# EAGLE design ServoEncoder_Serial (EAGLE 8.7.1)
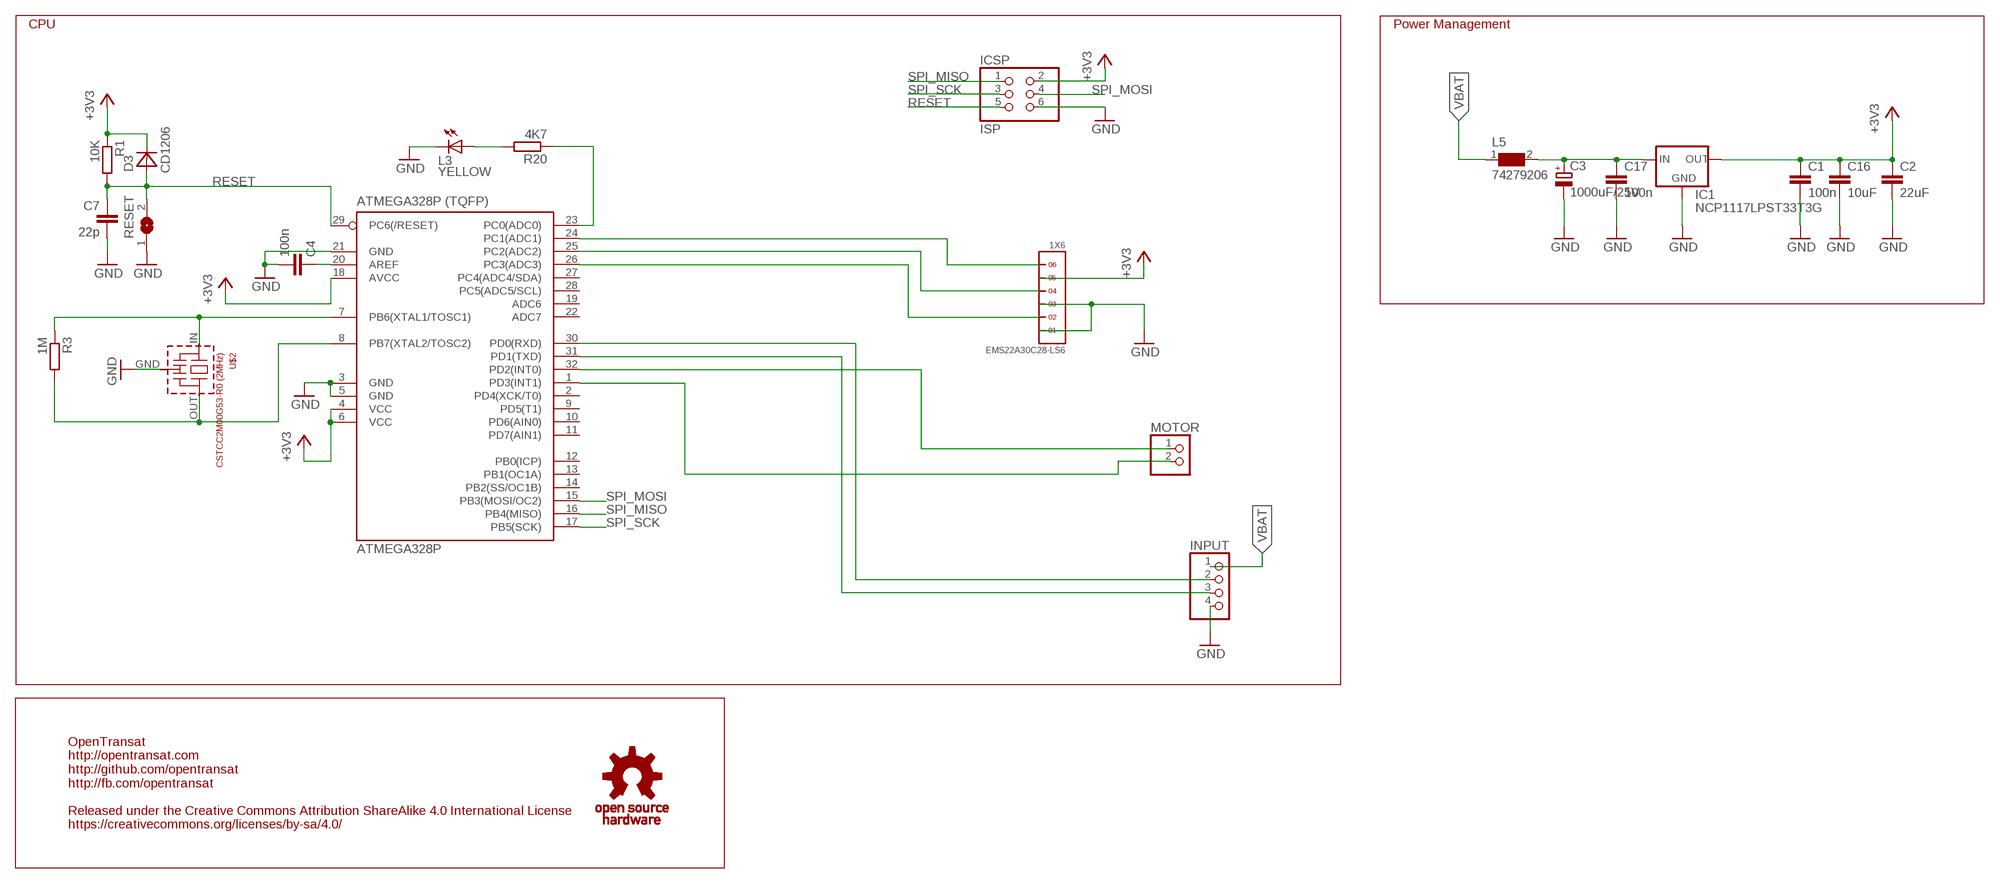
[diagram p0: schematic, sheet 1]

## Parts
ATMEGA328P  ATMEGA328P (TQFP)  MEGA8-AI  [TQFP32-08]
C1  100n  C-EUC0603  [C0603]
C2  22uF  C-EUC1210  [C1210]
C3  1000uF/25V  CPOL-EUE5-10.5  [E5-10,5]
C4  100n  C-EUC0603  [C0603]
C7  22p  C-EUC0603  [C0603]
C16  10uF  C-EUC1206  [C1206]
C17  100n  C-EUC0603  [C0603]
D3  CD1206  [R1206]
EMS22A30C28-LS6  1X6  [1X6]
IC1  NCP1117LPST33T3G  LM1117MP-3.3  [SOT223]
ICSP  ISP  PINHD-2X3  [2X03]
INPUT  PINHD-1X4  [1X04]
L3  YELLOW  LEDCHIPLED_0805  [CHIPLED_0805]
L5  74279206  WE-CBF_0805  [0805]
MOTOR  PINHD-1X2  [1X02]
R1  10K  R-EU_R0603  [R0603]
R3  1M  R-EU_R0603  [R0603]
R20  4K7  R-EU_R0603  [R0603]
RESET  SJW  [SJW]
U$1  OSHW_S  [OSHWS]
U$2  CSTCC2M00G53-R0 (2MHz)  CSTCC  [CSTCC]

## Nets
+3V3: ATMEGA328P.4(VCC) ATMEGA328P.6(VCC) ATMEGA328P.18(AVCC) C1.1 C2.1 C16.1 D3.2(C) EMS22A30C28-LS6.5 IC1.2(OUT) IC1.4(OUT) ICSP.2 R1.1
AREF: ATMEGA328P.20(AREF) C4.1
GND [GND]: ATMEGA328P.3(GND) ATMEGA328P.5(GND) ATMEGA328P.21(GND) C1.2 C2.2 C3.- C4.2 C7.2 C16.2 C17.2 EMS22A30C28-LS6.1 EMS22A30C28-LS6.3 IC1.1(GND) ICSP.6 INPUT.4 L3.C RESET.1 U$2.GND
L13: ATMEGA328P.23(PC0(ADC0)) R20.1
N$1: C3.+ C17.1 IC1.3(IN) L5.2
N$3: ATMEGA328P.30(PD0(RXD)) INPUT.2
N$4: L3.A R20.2
N$5: ATMEGA328P.31(PD1(TXD)) INPUT.3
N$6: ATMEGA328P.1(PD3(INT1)) MOTOR.2
N$7: ATMEGA328P.24(PC1(ADC1)) EMS22A30C28-LS6.6
N$8: ATMEGA328P.25(PC2(ADC2)) EMS22A30C28-LS6.4
N$9: ATMEGA328P.26(PC3(ADC3)) EMS22A30C28-LS6.2
N$11: ATMEGA328P.32(PD2(INT0)) MOTOR.1
RESET: ATMEGA328P.29(PC6(/RESET)) C7.1 D3.1(A) ICSP.5 R1.2 RESET.2
SPI_MISO: ATMEGA328P.16(PB4(MISO)) ICSP.1
SPI_MOSI: ATMEGA328P.15(PB3(MOSI/OC2)) ICSP.4
SPI_SCK: ATMEGA328P.17(PB5(SCK)) ICSP.3
VBAT: INPUT.1 L5.1
XTAL1: ATMEGA328P.8(PB7(XTAL2/TOSC2)) R3.2 U$2.OUT
XTAL2: ATMEGA328P.7(PB6(XTAL1/TOSC1)) R3.1 U$2.IN
Unconnected: ATMEGA328P.2(PD4(XCK/T0)) ATMEGA328P.9(PD5(T1)) ATMEGA328P.10(PD6(AIN0)) ATMEGA328P.11(PD7(AIN1)) ATMEGA328P.12(PB0(ICP)) ATMEGA328P.13(PB1(OC1A)) ATMEGA328P.14(PB2(SS/OC1B)) ATMEGA328P.19(ADC6) ATMEGA328P.22(ADC7) ATMEGA328P.27(PC4(ADC4/SDA)) ATMEGA328P.28(PC5(ADC5/SCL))

## Notes on the sheet
- CPU | Power Management
- OpenTransat
  http://opentransat.com
  http://github.com/opentransat
  http://fb.com/opentransat
  
  Released under the Creative Commons Attribution ShareAlike 4.0 International License
  https://creativecommons.org/licenses/by-sa/4.0/

## Library data of the parts
ATMEGA328P = atmel:MEGA8: MICROCONTROLLER 8 Kbytes FLASH, 1 kbytes SRAM, 512 bytes EEPROM, USART, 6-channel 10 bit ADC, 2-channel 8 bit ADC Pin compatible with Atmega48, ATMega88, ATMega168 Source: avr.lbr; MPN: ATMEGA8-16AU; OC_FARNELL: 9171371; OC_NEWARK: 73M8863
C1 C2 C4 C7 C16 C17 = rcl:C-EU: CAPACITOR, European symbol
C3 = transducer:CPOL-EU: POLARIZED CAPACITOR, European symbol
D3 = diodes_smd:CD1206
EMS22A30C28-LS6 = headers(2mm):1X6
IC1 = lm1117_10:LM1117?-*: 800mA Low-Dropout Linear Regulator Source: http://www.ti.com/lit/ds/symlink/lm1117-n.pdf; MF: Texas Instruments; MPN: LM1117MP-3.3; OC_FARNELL: 9778195; OC_NEWARK: 28X3416
ICSP = pinhead:PINHD-2X3: PIN HEADER
INPUT = pinhead:PINHD-1X4: PIN HEADER
L3 = led:LED: LED OSRAM: - CHIPLED LG R971, LG N971, LY N971, LG Q971, LY Q971, LO R971, LY R971 LH N974, LH R974 LS Q976, LO Q976, LY Q976 LO Q996 - Hyper CHIPLED LW Q18S LB Q993, LB Q99A, LB R99A - SideLED LS A670, LO A670, LY A670, LG A670, LP A670 LB A673, LV A673, LT A673, LW A673 LH A674 LY A675 LS A676, LA A676, LO A676, LY A676, LW A676 LS A679, LY A679, LG A679 - Hyper Micro SIDELED® LS Y876, LA Y876, LO Y876, LY Y876 LT Y87S - SmartLED LW L88C, LW L88S LB L89C, LB L89S, LG L890 LS L89K, LO L89K, LY L89K LS L896, LA L896, LO L896, LY L896 - TOPLED LS T670, LO T670, LY T670, LG T670, LP T670 LSG T670, LSP T670, LSY T670, LOP T670, LYG T670 LG T671, LOG T671, LSG T671 LB T673, LV T673, LT T673, LW T673 LH T674 LS T676, LA T676, LO T676, LY T676, LB T676, LH T676, LSB T676, LW T676 LB T67C, LV T67C, LT T67C, LS T67K, LO T67K, LY T67K, LW E67C LS E67B, LA E67B, LO E67B, LY E67B, LB E67C, LV E67C, LT E67C LW T67C LS T679, LY T679, LG T679 LS T770, LO T770, LY T770, LG T770, LP T770 LB T773, LV T773, LT T773, LW T773 LH T774 LS E675, LA E675, LY E675, LS T675 LS T776, LA T776, LO T776, LY T776, LB T776 LHGB T686 LT T68C, LB T68C - Hyper Mini TOPLED® LB M676 - Mini TOPLED Santana® LG M470 LS M47K, LO M47K, LY M47K Source: http://www.osram.convergy.de LUXEON: - LUMILED® LXK2-PW12-R00, LXK2-PW12-S00, LXK2-PW14-U00, LXK2-PW14-V00 LXK2-PM12-R00, LXK2-PM12-S00, LXK2-PM14-U00 LXK2-PE12-Q00, LXK2-PE12-R00, LXK2-PE12-S00, LXK2-PE14-T00, LXK2-PE14-U00 LXK2-PB12-K00, LXK2-PB12-L00, LXK2-PB12-M00, LXK2-PB14-N00, LXK2-PB14-P00, LXK2-PB14-Q00 LXK2-PR12-L00, LXK2-PR12-M00, LXK2-PR14-Q00, LXK2-PR14-R00 LXK2-PD12-Q00, LXK2-PD12-R00, LXK2-PD12-S00 LXK2-PH12-R00, LXK2-PH12-S00 LXK2-PL12-P00, LXK2-PL12-Q00, LXK2-PL12-R00 Source: www.luxeon.com KINGBRIGHT: KA-3528ASYC Source: www.kingbright.com
L5 = Wurth_Elektronik_Passive_rev15b:WE-CBF: SMD EMI Suppression Ferrite Beads WE-CBF - Excellent anti-EMI properties - Low DC-restistance - Impedances till 3000 ohms - Rated current up to 6 A -- Reliable Ni-Sn electrodes -- Perfect as data lined filter and for uncoupling of distribution voltage <http://katalog.we-online.de/media/images/eisos/FeCBF_pf2.jpg> Details see: http://katalog.we-online.de/en/pbs/WE-CBF updated by Dan Xu 2014-06-19 2014 (C) Würth Elektronik
MOTOR = pinhead:PINHD-1X2: PIN HEADER
R1 R3 R20 = rcl:R-EU_: RESISTOR, European symbol
RESET = jumper:SJ: SMD solder JUMPER
U$1 = oshw:OSHW_S
U$2 = murata-cstcc-cstcv-resonators:CSTCC: Murata CSTCC Resonator - 7,2 x 3,0 mm

## Net classes
1 power 5V: width 0.305 mm, drill 0.508 mm, clearance 0.203 mm
2 power 3.3V: width 0.305 mm, drill 0.508 mm, clearance 0.203 mm
3 GND: width 0.305 mm, drill 0.508 mm, clearance 0.203 mm
4 3A: width 1.372 mm, drill 0.635 mm, clearance 0.406 mm

## Board
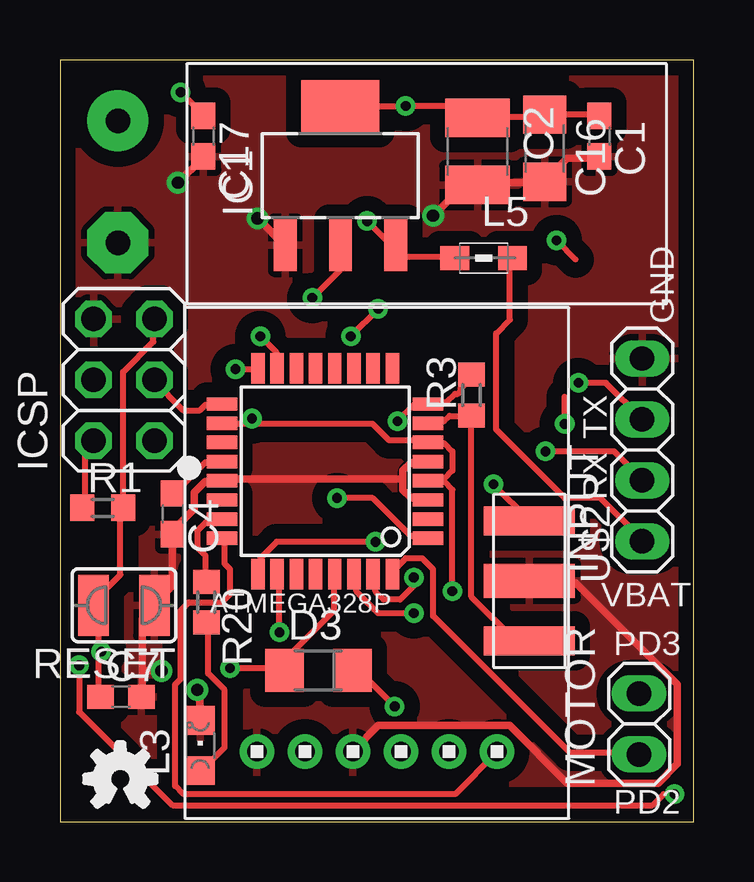
[diagram p1: board, top side]
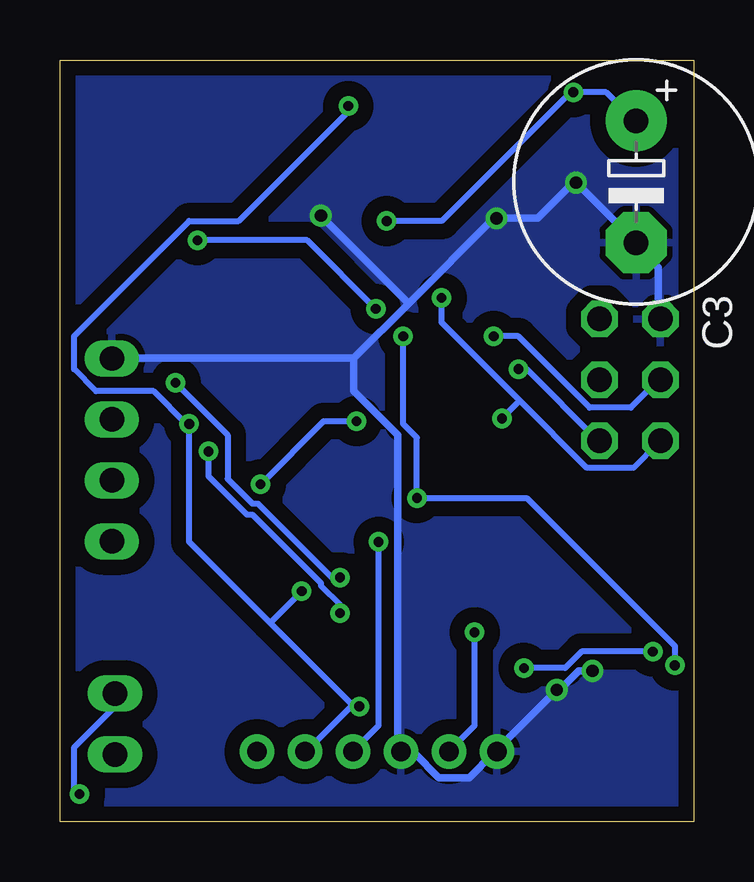
[diagram p2: board, bottom side, seen from below]

Size 26.42 x 31.75 mm. Coordinates in mm from the lower left corner, seen from the top.
Outline: 0,0 26.42,0 26.42,31.75 0,31.75 0,0
Copper layers (1*16): Top 0.035mm / dielectric 0.5mm / Bottom 0.035mm
Design rules "autorouter *": minimum track width 10mil, minimum drill 16mil, track to track 8mil, track to pad 8mil, pad to pad 8mil, via to via 8mil, smd to smd 8mil, copper to edge 15mil, drill to drill 12mil, minimum pad ring 10mil, minimum via ring 8mil, stop-mask expansion 1mil, vias tented up to drill 30mil, thermal gap 10mil

### Footprints (pad centres in the part's own frame; a part is rotated, then mirrored left to right if it is on the bottom)
TQFP32-08 = smd 1.27 x 0.559: 1 -4.293,2.8; 2 -4.293,2; 3 -4.293,1.2; 4 -4.293,0.4; 5 -4.293,-0.4; 6 -4.293,-1.2; 7 -4.293,-2; 8 -4.293,-2.8; 17 4.293,-2.8; 18 4.293,-2; 19 4.293,-1.2; 20 4.293,-0.4; 21 4.293,0.4; 22 4.293,1.2; 23 4.293,2; 24 4.293,2.8 | smd 0.559 x 1.27: 9 -2.8,-4.293; 10 -2,-4.293; 11 -1.2,-4.293; 12 -0.4,-4.293; 13 0.4,-4.293; 14 1.2,-4.293; 15 2,-4.293; 16 2.8,-4.293; 25 2.8,4.293; 26 2,4.293; 27 1.2,4.293; 28 0.4,4.293; 29 -0.4,4.293; 30 -1.2,4.293; 31 -2,4.293; 32 -2.8,4.293
C0603 = smd 1.1 x 1: 1 -0.85,0; 2 0.85,0
C1210 = smd 1.6 x 2.7: 1 -1.4,0; 2 1.4,0
E5-10,5 = drill 1.016 pad 2.54: + -2.54,0 | drill 1.016 pad 2.54 octagon: - 2.54,0
C1206 = smd 1.6 x 1.8: 1 -1.4,0; 2 1.4,0
R1206 = smd 1.6 x 1.803: 1 -1.422,0; 2 1.422,0
1X6 = drill 0.8 pad 1.422: 1 -5,0; 2 -3,0; 3 -1,0; 4 1,0; 5 3,0; 6 5,0
SOT223 = smd 0.95 x 2.15: 1 -2.3,-2.9; 2 0,-2.9; 3 2.3,-2.9 | smd 3.25 x 2.15: 4 0,2.9
2X03 = drill 1.016 octagon: 1 -2.54,-1.27; 2 -2.54,1.27; 3 0,-1.27; 4 0,1.27; 5 2.54,-1.27; 6 2.54,1.27
1X04 = drill 1.016 long: 1 -3.81,0; 2 -1.27,0; 3 1.27,0; 4 3.81,0
CHIPLED_0805 = smd 1.2 x 1.2: A 0,-1.05; C 0,1.05
0805 = smd 1.2 x 1: 1 -1.2,0; 2 1.2,0
1X02 = drill 1.016 long: 1 -1.27,0; 2 1.27,0
R0603 = smd 1 x 1.1: 1 -0.85,0; 2 0.85,0
SJW = smd 1.27 x 2.54: 1 -1.27,0; 2 1.27,0
CSTCC = smd 1.4 x 3.8: GND 0,0 | smd 1.2 x 3.8: IN 2.5,0; OUT -2.5,0

### Placement (x,y rotation side)
ATMEGA328P  11.05,14.61 180 top
C1  22.48,28.57 270 top
C2  17.4,27.94 270 top
C3  2.41,26.67 270 bottom
C4  4.7,12.83 270 top
C7  2.54,5.21 0 top
C16  20.19,28.07 270 top
C17  5.97,28.57 270 top
D3  10.77,6.3 0 top
EMS22A30C28-LS6  13.21,2.92 0 top
IC1  11.68,26.92 0 top
ICSP  2.67,18.41 90 top
INPUT  24.26,15.49 90 top
L3  5.84,3.17 0 top
L5  17.65,23.5 180 top
MOTOR  24.13,4.06 90 top
R1  1.78,13.08 0 top
R3  17.14,17.78 90 top
R20  6.1,9.14 270 top
RESET  2.67,9.02 180 top
U$1  2.51,1.78 0 top
U$2  19.56,10.03 270 top

### Tracks (layer width: path | path; a pad name or v marks a point on that pad's centre or on a via)
+3V3  (via drill 0.41)
  Top 0.254: 16,14.29 15.32,14.29 ATMEGA328P.4 | 16,14.29 16.34,14.63 16.34,15.43 16,15.77 15.43,15.77 ATMEGA328P.6 15.32,15.89 13.72,15.89 13.03,16.57 8,16.57 | 8,16.57 6.86,16.57 6.86,16.69 ATMEGA328P.18 | R1.1 1.03,13.14 1.03,15.43 1.37,15.77 ICSP.2 | 11.66,23.55 11.66,22.97 v10.52,21.83 | v8,16.8 8,16.57 | C1.1 22.4,29.49 20.23,29.49 C16.1 20.12,29.38 17.49,29.38 C2.1 17.37,29.38 16.92,29.83 v14.4,29.83 11.77,29.83 | v13.95,4.8 12.46,6.29 D3.2 | v21.03,16.57 21.03,17.72 | v16.34,9.6 16.34,13.83 16,14.17 16,14.29
  Top 0.305: IC1.4 11.77,29.82 11.77,29.83 | IC1.2 11.68,23.57 11.66,23.55
  Bottom 0.254: v10.52,21.83 10.52,20.8 7.26,17.55 | 7.26,17.55 4.46,14.74 2.52,14.74 1.49,15.77 ICSP.2 | 7.26,17.55 v8,16.8 | EMS22A30C28-LS6.5 16.12,2.97 14.29,4.8 v13.95,4.8 14.29,4.92 17.66,8.29 | 17.66,8.29 21.03,11.66 v21.03,16.57 21.14,16.57 22.52,17.95 24.92,17.95 25.83,18.86 25.83,20.23 21.03,25.03 18.97,25.03 14.29,29.72 14.29,29.83 v14.4,29.83 | 17.66,8.29 v16.34,9.6
AREF
  Top 0.254: 4.8,13.72 6.06,14.97 6.74,14.97 6.74,15.09 ATMEGA328P.20
  Top 0.305: C4.1 4.76,13.68 4.8,13.72
GND  (via drill 0.51)
  Top 0.305: 14.29,14.29 14.29,14.63 14.63,14.97 15.32,14.97 ATMEGA328P.5 | 14.29,14.29 14.29,13.83 14.63,13.49 15.32,13.49 ATMEGA328P.3 | 3.43,6.29 3.43,8.46 3.89,8.91 RESET.1 4,9.14 4.69,9.83 4.69,11.89 C4.2 4.69,12.12 5.6,13.03 5.6,13.72 6.06,14.17 6.74,14.17 ATMEGA328P.21 6.86,14.29 14.29,14.29 | 3.43,6.29 3.43,5.26 C7.2 | v5.71,5.49 5.83,5.37 5.83,4.23 L3.C | U$2.GND 19.66,9.94 21.49,9.94 25.72,5.71 25.72,2.4 24.92,1.6 21.14,1.6 18.75,4 13.26,4 12.23,2.97 EMS22A30C28-LS6.3 | v4.23,6.29 3.43,6.29 | C1.2 22.4,27.66 21.14,27.66 20.23,26.75 C16.2 20.12,26.63 17.49,26.63 C2.2 17.26,26.52 16.8,26.52 v15.54,25.26 | v4.92,26.63 5.94,27.66 C17.2 | v8.23,25.15 9.37,24 IC1.1
  Bottom 0.305: v4.23,6.29 4.8,6.29 5.6,5.49 v5.71,5.49 8.23,2.97 EMS22A30C28-LS6.1 8.34,2.86 9.37,1.83 10.63,1.83 11.66,2.86 12.12,2.86 EMS22A30C28-LS6.3 12.34,2.97 12.34,16.12 14.17,17.95 14.17,19.32 | ICSP.6 1.49,21.03 1.49,23.09 2.4,24 C3.- v4.92,26.63 5.03,26.63 6.51,25.15 v8.23,25.15 8.34,25.15 11.89,21.6 | 14.17,19.32 24.23,19.32 INPUT.4 | 11.89,21.6 14.17,19.32 | 11.89,21.6 v15.54,25.26
  pour Top (isolate 0.635): 0,0 26.42,0 26.42,31.75 0,31.75
  pour Bottom (isolate 0.635): 0,0 28.45,0 28.45,33.27 0,33.27
L13
  Top 0.254: R20.1 6.06,10.06 6.06,11.09 5.71,11.43 5.71,12.12 6.17,12.57 6.74,12.57 6.74,12.69 ATMEGA328P.23
N$1  (via drill 0.41)
  Top 0.254: 14.06,23.55 16.46,23.55 L5.2 | v5.03,30.4 5.94,29.49 C17.1 | 13.95,23.66 13.95,23.89 13.89,23.95 | v12.8,25.03 13.89,23.95 | IC1.3 13.95,24 13.89,23.95
  Top 0.305: 14.06,23.55 13.98,23.62 IC1.3
  Bottom 0.254: C3.+ 2.52,29.26 3.66,30.4 v5.03,30.4 5.14,30.4 10.52,25.03 v12.8,25.03
N$3  (via drill 0.41)
  Top 0.254: v14.74,8.69 13.26,8.69 12.34,9.6 12.34,10.29 ATMEGA328P.30 | v20.23,15.43 23.09,15.43 24.23,14.29 INPUT.2
  Bottom 0.254: v14.74,8.69 14.74,9.03 15.54,9.83 15.54,9.94 18.4,12.8 18.63,12.8 20.23,14.4 v20.23,15.43
N$4
  Top 0.254: R20.2 6.17,8.23 6.17,6.17 6.86,5.49 6.86,3.09 5.94,2.17 L3.A
N$5  (via drill 0.41)
  Top 0.254: v14.74,10.17 14.74,9.83 14.17,9.26 13.49,9.26 13.14,9.6 13.14,10.29 ATMEGA328P.31 | v21.6,18.29 22.75,18.29 24.23,16.8 INPUT.3
  Bottom 0.254: v14.74,10.17 15.09,10.17 18.17,13.26 18.4,13.26 19.43,14.29 19.43,16.12 v21.6,18.29
N$6  (via drill 0.41)
  Top 0.254: v20.69,24.23 21.49,23.43 | v12.12,20.23 v13.26,21.37 | v11.54,13.49 13.03,13.49 14.63,11.89 15.32,11.89 ATMEGA328P.1 | v25.6,1.14 25.15,1.14 24.69,0.69 4.69,0.69 0.8,4.57 v0.8,6.51
  Bottom 0.254: v20.69,24.23 16.12,24.23 v13.26,21.37 | v12.12,20.23 12.12,16.57 11.54,16 v11.54,13.49 6.97,13.49 0.8,7.32 v0.8,6.51 | v25.6,1.14 25.83,1.37 25.83,3.09 24.23,4.69 24.23,5.26 MOTOR.2
N$7
  Top 0.254: EMS22A30C28-LS6.6 18.17,2.86 16.46,1.14 5.14,1.14 4.8,1.49 4.8,5.71 5.03,5.94 5.03,8.8 5.37,9.14 6.74,9.14 7.09,9.49 7.09,10.52 6.86,10.74 6.86,11.89 ATMEGA328P.24
N$8  (via drill 0.41)
  Top 0.254: v13.14,11.66 9.03,11.66 8.34,10.97 8.34,10.4 8.23,10.4 ATMEGA328P.25
  Bottom 0.254: v13.14,11.66 13.14,4 14.17,2.97 EMS22A30C28-LS6.4
N$9  (via drill 0.41)
  Top 0.254: v9.14,7.89 9.14,10.4 ATMEGA328P.26
  Bottom 0.254: v9.14,7.89 9.14,4 10.17,2.97 EMS22A30C28-LS6.2
N$11
  Top 0.254: ATMEGA328P.32 13.95,10.4 13.95,10.52 14.4,10.97 15.09,10.97 15.54,10.52 15.54,8.57 21.26,2.86 24.12,2.86 MOTOR.1
RESET  (via drill 0.41)
  Top 0.254: 1.6,7.09 1.6,8.8 1.49,8.91 RESET.2 1.37,9.14 2.52,10.29 2.52,13.03 R1.2 2.63,13.14 2.63,18.75 3.89,20 3.89,20.92 ICSP.5 | 1.6,7.09 1.6,5.26 C7.1 | v7.09,6.4 8.91,6.4 D3.1 9.03,6.4 11.43,8.8 11.43,10.4 ATMEGA328P.29 | v1.71,7.09 1.6,7.09
  Bottom 0.254: v7.09,6.4 5.37,6.4 4.69,7.09 v1.71,7.09
SPI_MISO  (via drill 0.41)
  Top 0.254: v7.32,18.86 8.23,18.86 8.23,18.97 ATMEGA328P.16
  Bottom 0.254: v7.32,18.86 6.97,18.86 4,15.89 ICSP.1
SPI_MOSI  (via drill 0.41)
  Top 0.254: v8.34,20.23 9.03,19.55 9.03,18.97 ATMEGA328P.15
  Bottom 0.254: v8.34,20.23 7.32,20.23 4.34,17.26 2.63,17.26 1.49,18.4 ICSP.4
SPI_SCK
  Top 0.254: ICSP.3 3.89,18.4 5.14,17.14 5.83,17.14 6.06,17.37 6.74,17.37 6.74,17.49 ATMEGA328P.17
VBAT
  Top 0.254: L5.1 18.75,23.43 18.75,20.92 18.17,20.34 18.17,16.34 21.03,13.49 22.52,13.49 24.23,11.77 INPUT.1
XTAL1  (via drill 0.41)
  Top 0.254: R3.2 17.14,18.52 16.69,18.06 16.69,17.95 16.57,17.83 16.46,17.83 16.12,17.49 15.43,17.49 15.43,17.37 ATMEGA328P.8 15.32,17.49 15.32,17.37 14.74,17.37 v14.06,16.69 | v18.06,14.06 19.55,12.57 U$2.OUT
  Bottom 0.254: v14.06,16.69 15.43,16.69 v18.06,14.06
XTAL2
  Top 0.254: U$2.IN 19.55,7.54 18.97,7.54 17.14,9.37 R3.1 17.14,16.92 16.23,16.92 16,16.69 15.32,16.69 ATMEGA328P.7

### Text on the board
tSilk: GND | TX | RX | VBAT | PD3 | PD2